# EAGLE design nico (EAGLE 7.1.0)
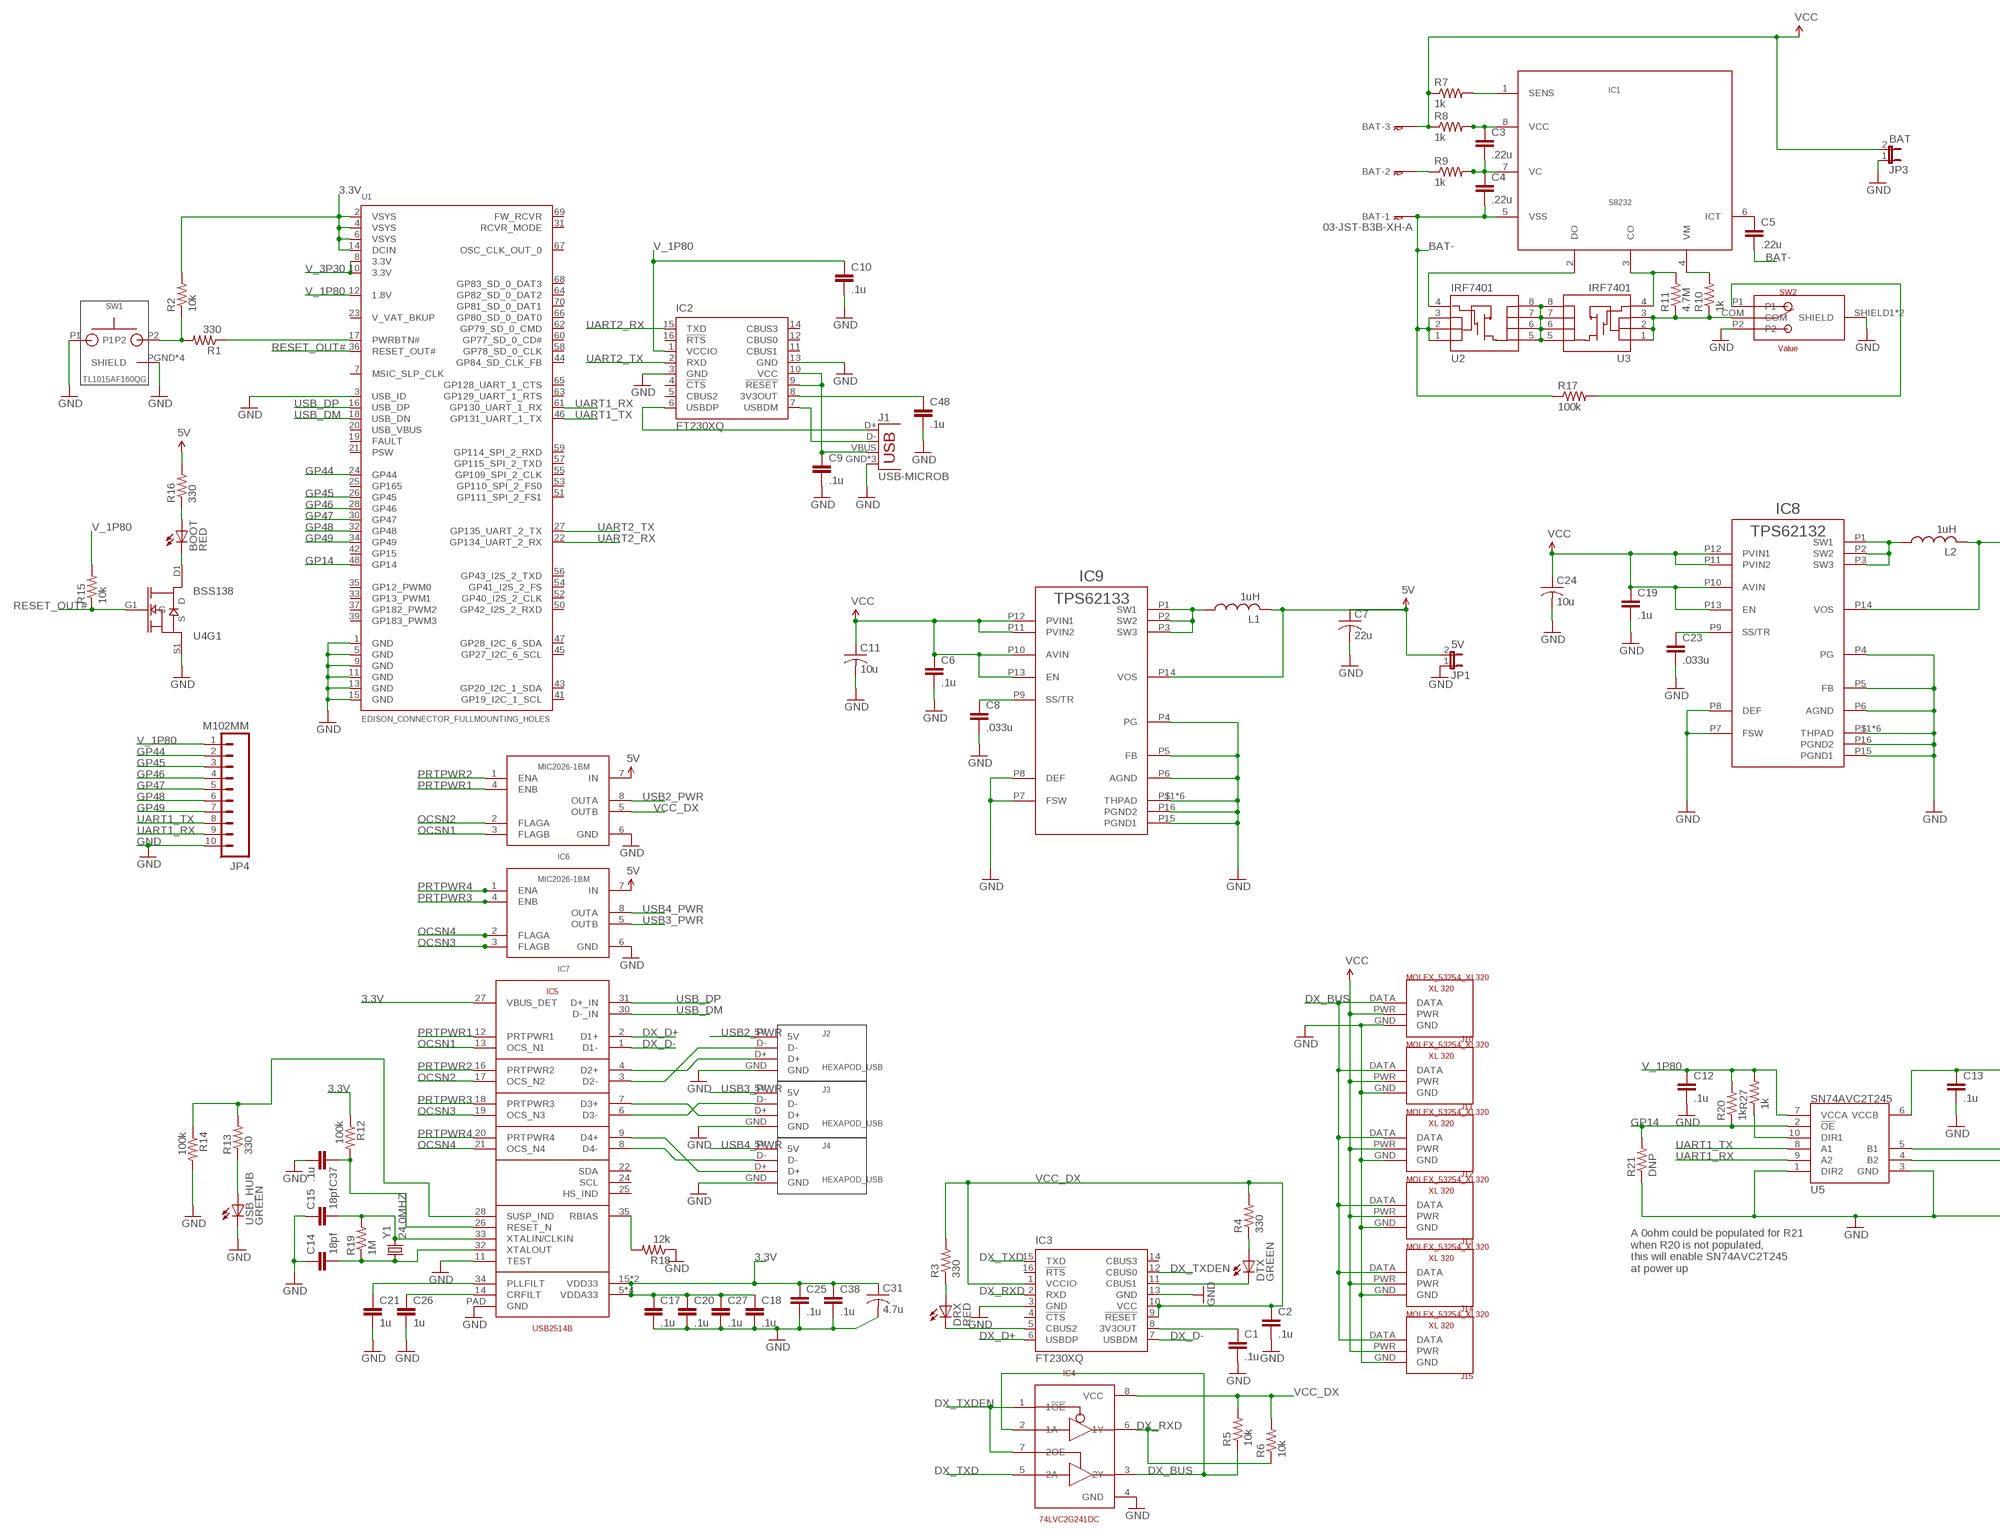
[diagram p0: schematic, sheet 1, part 1 of 2]
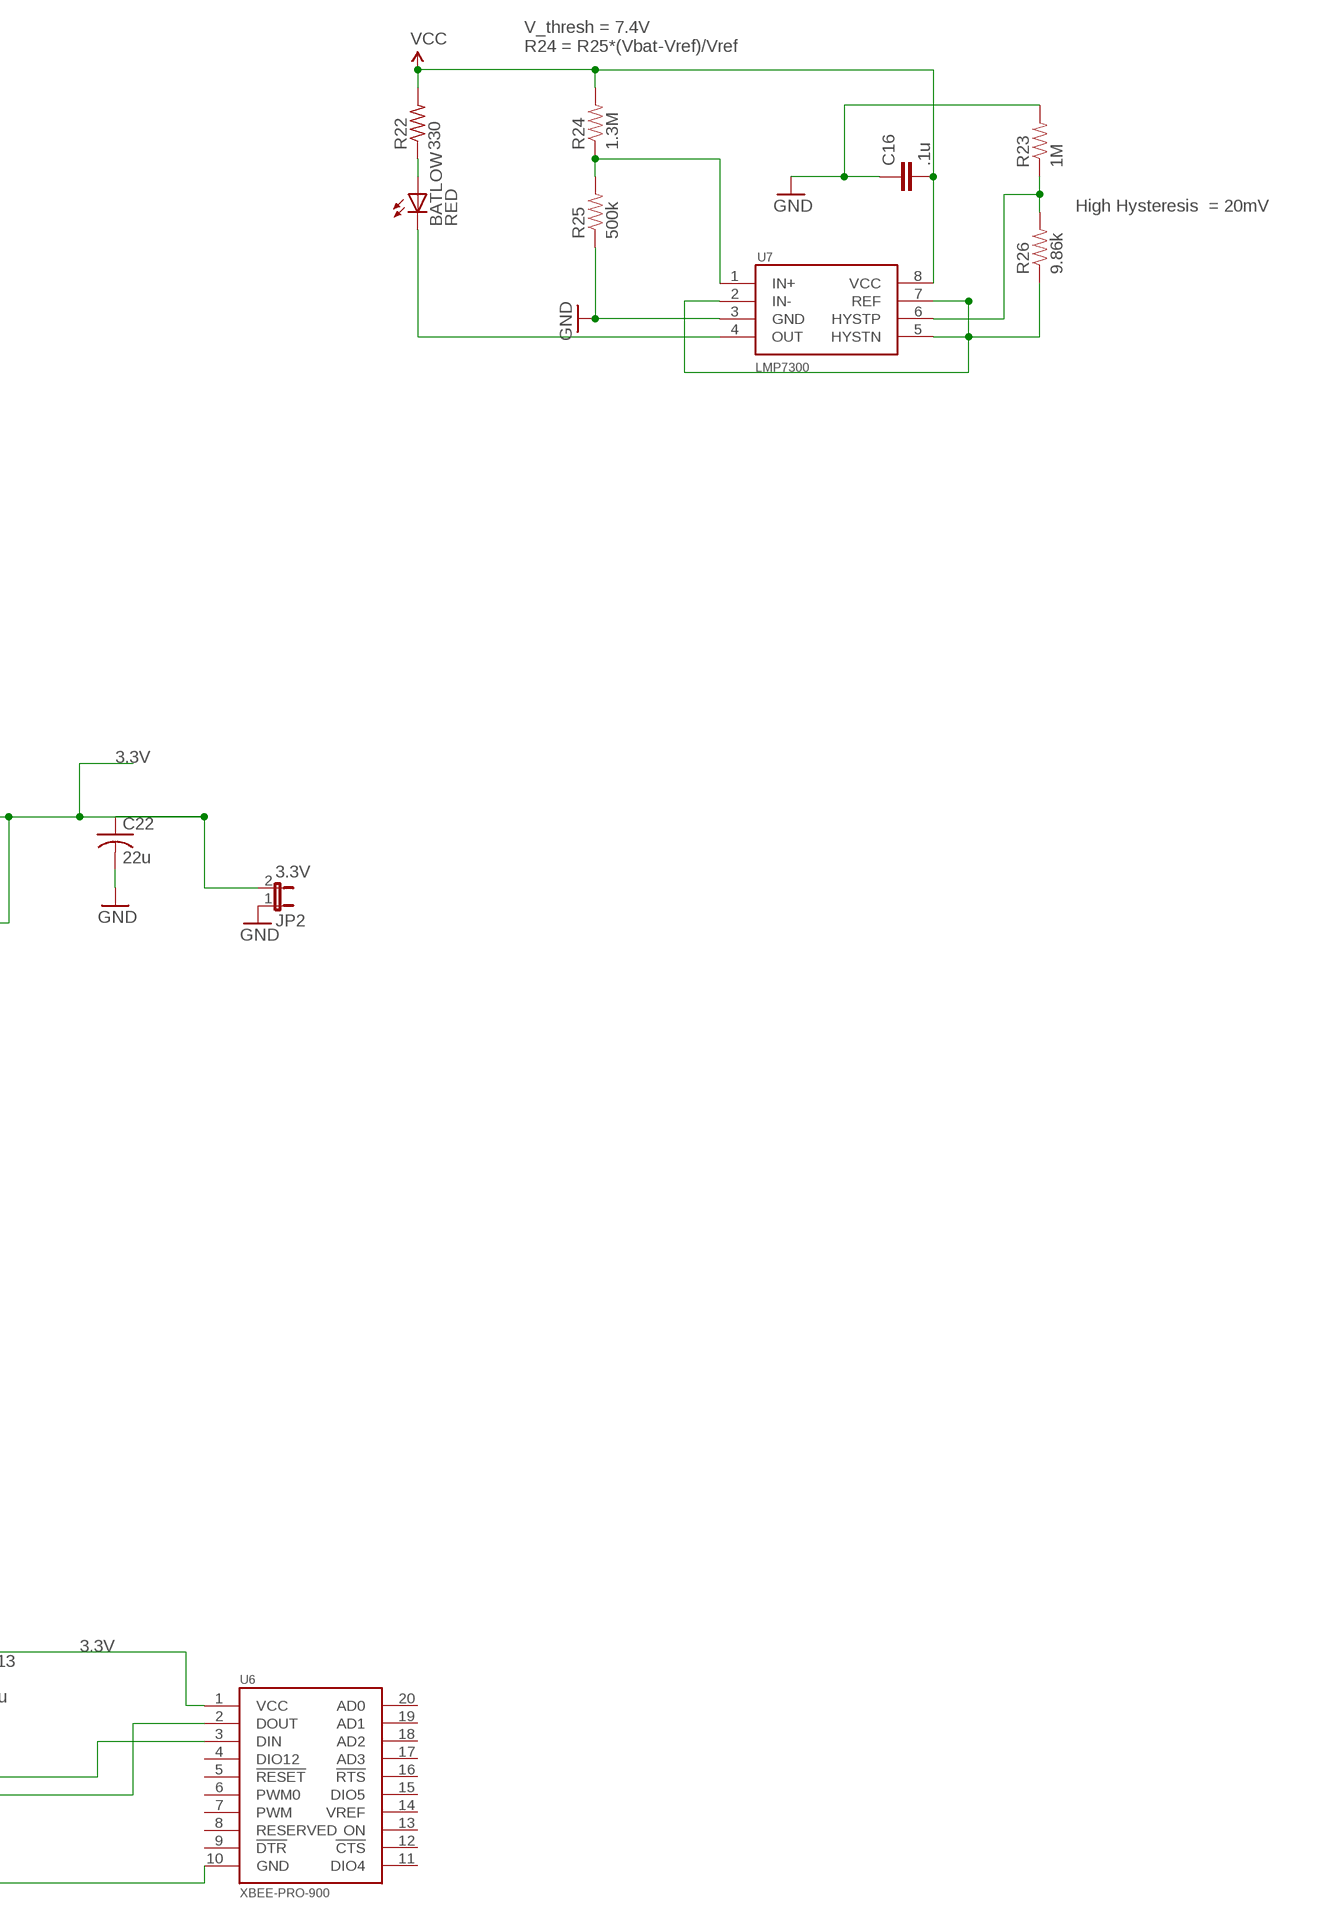
[diagram p1: schematic, sheet 1, part 2 of 2]

## Parts
BAT  03-JST-B3B-XH-A  [B3B-XH]
BATLOW  RED  LED0603  [LED-0603]
BOOT  RED  LED0603  [LED-0603]
C1  .1u  C-EUC0402  [C0402]
C2  .1u  C-EUC0402  [C0402]
C3  .22u  C-EUC0402  [C0402]
C4  .22u  C-EUC0402  [C0402]
C5  .22u  C-EUC0402  [C0402]
C6  .1u  C-EUC0402  [C0402]
C7  22u  C-USC0603  [C0603]
C8  .033u  C-EUC0402  [C0402]
C9  .1u  C-EUC0402  [C0402]
C10  .1u  C-EUC0402  [C0402]
C11  10u  C-USC0805  [C0805]
C12  .1u  C-EUC0402  [C0402]
C13  .1u  C-EUC0402  [C0402]
C14  18pf  C-EUC0402  [C0402]
C15  18pf  C-EUC0402  [C0402]
C16  .1u  C-EUC0402  [C0402]
C17  .1u  C-EUC0402  [C0402]
C18  .1u  C-EUC0402  [C0402]
C19  .1u  C-EUC0402  [C0402]
C20  .1u  C-EUC0402  [C0402]
C21  1u  C-EUC0402  [C0402]
C22  22u  C-USC0603  [C0603]
C23  .033u  C-EUC0402  [C0402]
C24  10u  C-USC0805  [C0805]
C25  .1u  C-EUC0402  [C0402]
C26  1u  C-EUC0402  [C0402]
C27  .1u  C-EUC0402  [C0402]
C31  4.7u  C-USC0603  [C0603]
C37  .1u  C-EUC0402  [C0402]
C38  .1u  C-EUC0402  [C0402]
C48  .1u  C-EUC0402  [C0402]
DRX  RED  LED0603  [LED-0603]
DTX  GREEN  LED0603  [LED-0603]
IC1  S8232  [TSSOP8]
IC2  FT230XQ  [QFN16]
IC3  FT230XQ  [QFN16]
IC4  74LVC2G241DC  [VSSOP]
IC5  USB2514B  [36-QFN]
IC6  MIC2026-1BM  [8-SOIC]
IC7  MIC2026-1BM  [8-SOIC]
IC8  TPS62132  TPS62133  [VQFN-16]
IC9  TPS62133  [VQFN-16]
J1  USB-MICROB  [USB-MICROB]
J2  HEXAPOD_USB  [MOLEX_53254_4POS]
J3  HEXAPOD_USB  [MOLEX_53254_4POS]
J4  HEXAPOD_USB  [MOLEX_53254_4POS]
J10  MOLEX_53254_XL320  [MOLES_53254_XL320]
J11  MOLEX_53254_XL320  [MOLES_53254_XL320]
J12  MOLEX_53254_XL320  [MOLES_53254_XL320]
J13  MOLEX_53254_XL320  [MOLES_53254_XL320]
J14  MOLEX_53254_XL320  [MOLES_53254_XL320]
J15  MOLEX_53254_XL320  [MOLES_53254_XL320]
JP1  5V  JUMPER-2PTH  [1X02]
JP2  3.3V  JUMPER-2PTH  [1X02]
JP3  BAT  JUMPER-2PTH  [1X02]
JP4  M102MM  [1X10-2MM]
L1  1uH  L-USL2825P  [L2825P]
L2  1uH  L-USL2825P  [L2825P]
R1  330  R-US_R0402  [R0402]
R2  10k  R-US_R0402  [R0402]
R3  330  R-US_R0402  [R0402]
R4  330  R-US_R0402  [R0402]
R5  10k  R-US_R0402  [R0402]
R6  10k  R-US_R0402  [R0402]
R7  1k  RESISTOR0402  [C0402]
R8  1k  RESISTOR0402  [C0402]
R9  1k  RESISTOR0402  [C0402]
R10  1k  RESISTOR0402  [C0402]
R11  4.7M  RESISTOR0402  [C0402]
R12  100k  RESISTOR0402  [C0402]
R13  330  R-US_R0402  [R0402]
R14  100k  RESISTOR0402  [C0402]
R15  10k  R-US_R0402  [R0402]
R16  330  R-US_R0402  [R0402]
R17  100k  RESISTOR0402  [C0402]
R18  12k  RESISTOR0402  [C0402]
R19  1M  RESISTOR0402  [C0402]
R20  1k  RESISTOR0402  [C0402]
R21  DNP  RESISTOR0402  [C0402]
R22  330  R-US_R0402  [R0402]
R23  1M  RESISTOR0402  [C0402]
R24  1.3M  RESISTOR0402  [C0402]
R25  500k  RESISTOR0402  [C0402]
R26  9.86k  RESISTOR0402  [C0402]
R27  1k  RESISTOR0402  [C0402]
SW1  TL1015AF160QG  [TL1015AF160QG]
SW2  TOGGLE_SWITCH_ET01MD1AGE  [TOGGLE_SWITCH_ET01MD1AGE]
U1  EDISON_CONNECTOR_FULLMOUNTING_HOLES  [EDISON_DAUGHTER]
U2  IRF7401  MOSFET-NCHANNEL-SOIC8  [SO08]
U3  IRF7401  MOSFET-NCHANNEL-SOIC8  [SO08]
U4  BSS138  [SOT363]
U5  SN74AVC2T245  [RSW-UQFN-10]
U6  XBEE-PRO-900  [XBEE-PRO-OEM]
U7  LMP7300  [8-SOIC]
USB_HUB  GREEN  LED0603  [LED-0603]
Y1  24.0MHZ  CRYSTAL5X3  [CRYSTAL-SMD-5X3]

## Nets
3.3V: C13.1 C17.1 C18.1 C20.1 C22.1 C25.1 C27.1 C31.1 C38.1 IC5.5(VDDA33) IC5.10(VDDA33) IC5.15(VDD33) IC5.23(VDD33) IC5.27(VBUS_DET) IC5.29(VDDA33) IC5.36(VDDA33) IC8.P14(VOS) JP2.2 L2.2 R2.2 R12.1 U1.2(VSYS) U1.4(VSYS) U1.6(VSYS) U1.14(DCIN) U5.6(VCCB) U6.1(VCC)
5V: C7.1 IC6.7(IN) IC7.7(IN) IC9.P14(VOS) JP1.2 L1.2 R16.2
BAT-: BAT.P$1 C4.2 C5.2 IC1.5(VSS) R17.1 U2.1(S) U2.2(S) U2.3(S)
DX_BUS: IC4.2(1A) IC4.3(2Y) J10.DATA J11.DATA J12.DATA J13.DATA J14.DATA J15.DATA R5.1
DX_D+: IC3.6(USBDP) IC5.2(D1+)
DX_D-: IC3.7(USBDM) IC5.1(D1-)
DX_RXD: IC3.2(RXD) IC4.6(1Y) R6.1
DX_TXD: IC3.15(TXD) IC4.5(2A)
DX_TXDEN: IC3.12(CBUS0) IC4.1(1!OE) IC4.7(2OE)
GND [GND]: C1.2 C2.2 C6.2 C7.2 C8.2 C9.2 C10.2 C11.2 C12.2 C13.2 C14.1 C15.1 C16.1 C17.2 C18.2 C19.2 C20.2 C21.2 C22.2 C23.2 C24.2 C25.2 C26.2 C27.2 C31.2 C37.2 C38.2 C48.2 IC2.3(GND) IC2.13(GND) IC3.3(GND) IC3.13(GND) IC4.4(GND) IC5.11(TEST) IC5.PAD(GND) IC6.6(GND) IC7.6(GND) IC8.P4(PG) IC8.P5(FB) IC8.P6(AGND) IC8.P7(FSW) IC8.P8(DEF) IC8.P15(PGND1) IC8.P16(PGND2) IC8.P$1(THPAD) IC8.P$2(THPAD) IC8.P$3(THPAD) IC8.P$4(THPAD) IC8.P$5(THPAD) IC8.P$6(THPAD) IC9.P4(PG) IC9.P5(FB) IC9.P6(AGND) IC9.P7(FSW) IC9.P8(DEF) IC9.P15(PGND1) IC9.P16(PGND2) IC9.P$1(THPAD) IC9.P$2(THPAD) IC9.P$3(THPAD) IC9.P$4(THPAD) IC9.P$5(THPAD) IC9.P$6(THPAD) J1.GND J1.MT1(GND) J1.MT2(GND) J2.GND J3.GND J4.GND J10.GND J11.GND J12.GND J13.GND J14.GND J15.GND JP1.1 JP2.1 JP3.1 JP4.10 R14.2 R18.1 R21.1 R23.2 R25.1 SW1.P1 SW1.PGND2(SHIELD) SW1.PGND3(SHIELD) SW1.PGND4(SHIELD) SW1.PGND(SHIELD) SW2.P2 SW2.SHIELD1(SHIELD) SW2.SHIELD2(SHIELD) U1.1(GND) U1.3(USB_ID) U1.5(GND) U1.9(GND) U1.11(GND) U1.13(GND) U1.15(GND) U4.S1(S) U5.1(DIR2) U5.3(GND) U6.10(GND) U7.3(GND) USB_HUB.C
GP14: R20.1 R21.2 U1.48(GP14) U5.2(!OE)
GP44: JP4.2 U1.24(GP44)
GP45: JP4.3 U1.26(GP45)
GP46: JP4.4 U1.28(GP46)
GP47: JP4.5 U1.30(GP47)
GP48: JP4.6 U1.32(GP48)
GP49: JP4.7 U1.34(GP49)
N$1: R1.2 R2.1 SW1.P2
N$2: DRX.C IC3.5(CBUS2)
N$3: C1.1 IC3.8(3V3OUT)
N$4: IC2.6(USBDP) J1.D+
N$5: C15.2 IC5.33(XTALIN/CLKIN) R19.2 Y1.3
N$6: C14.2 IC5.32(XTALOUT) R19.1 Y1.1
N$7: IC5.7(D3+) J3.D+
N$8: C3.2 C4.1 IC1.7(VC) R9.2
N$9: C3.1 IC1.8(VCC) R8.2
N$10: R1.1 U1.17(PWRBTN#)
N$11: C8.1 IC9.P9(SS/TR)
N$12: R13.1 USB_HUB.A
N$13: DTX.A R4.1
N$14: C21.1 IC5.34(PLLFILT)
N$15: C26.1 IC5.14(CRFILT)
N$16: DTX.C IC3.11(CBUS1)
N$17: IC8.P1(SW1) IC8.P2(SW2) IC8.P3(SW3) L2.1
N$18: IC2.7(USBDM) J1.D-
N$19: C37.1 IC5.26(RESET_N) R12.2
N$20: C9.1 IC2.9(!RESET) IC2.10(VCC) J1.VBUS
N$21: DRX.A R3.1
N$22: C23.1 IC8.P9(SS/TR)
N$23: IC5.9(D4+) J4.D+
N$24: IC5.28(SUSP_IND) R13.2 R14.1
N$25: C48.1 IC2.8(3V3OUT)
N$26: IC5.35(RBIAS) R18.2
N$27: IC5.8(D4-) J4.D-
N$28: C5.1 IC1.6(ICT)
N$29: IC1.1(SENS) R7.2
N$30: BAT.P$2 R9.1
N$31: IC5.6(D3-) J3.D-
N$32: IC1.4(VM) R10.2
N$33: R10.1 R11.1 SW2.COM U3.1(S) U3.2(S) U3.3(S)
N$34: BOOT.C U4.D1(D)
N$35: U2.5(D) U2.6(D) U2.7(D) U2.8(D) U3.5(D) U3.6(D) U3.7(D) U3.8(D)
N$36: BOOT.A R16.1
N$37: IC1.2(DO) U2.4(G)
N$38: IC1.3(CO) R11.2 U3.4(G)
N$39: IC5.3(D2-) J2.D-
N$40: IC5.4(D2+) J2.D+
N$41: IC9.P1(SW1) IC9.P2(SW2) IC9.P3(SW3) L1.1
N$42: R17.2 SW2.P1
N$43: BATLOW.C U7.4(OUT)
N$44: BATLOW.A R22.1
N$45: R26.1 U7.2(IN-) U7.5(HYSTN) U7.7(REF)
N$46: R23.1 R26.2 U7.6(HYSTP)
N$47: R24.1 R25.2 U7.1(IN+)
N$48: R27.1 U5.10(DIR1)
N$49: U5.5(B1) U6.3(DIN)
N$50: U5.4(B2) U6.2(DOUT)
OCSN1: IC5.13(OCS_N1) IC6.3(FLAGB)
OCSN2: IC5.17(OCS_N2) IC6.2(FLAGA)
OCSN3: IC5.19(OCS_N3) IC7.3(FLAGB)
OCSN4: IC5.21(OCS_N4) IC7.2(FLAGA)
PRTPWR1: IC5.12(PRTPWR1) IC6.4(ENB)
PRTPWR2: IC5.16(PRTPWR2) IC6.1(ENA)
PRTPWR3: IC5.18(PRTPWR3) IC7.4(ENB)
PRTPWR4: IC5.20(PRTPWR4) IC7.1(ENA)
RESET_OUT#: R15.1 U1.36(RESET_OUT#) U4.G1(G)
UART1_RX: JP4.9 U1.61(GP130_UART_1_RX) U5.9(A2)
UART1_TX: JP4.8 U1.46(GP131_UART_1_TX) U5.8(A1)
UART2_RX: IC2.15(TXD) U1.22(GP134_UART_2_RX)
UART2_TX: IC2.2(RXD) U1.27(GP135_UART_2_TX)
USB2_PWR: IC6.8(OUTA) J2.5V
USB3_PWR: IC7.5(OUTB) J3.5V
USB4_PWR: IC7.8(OUTA) J4.5V
USB_DM: IC5.30(D-_IN) U1.18(USB_DN)
USB_DP: IC5.31(D+_IN) U1.16(USB_DP)
V_1P80: C10.1 C12.1 IC2.1(VCCIO) JP4.1 R15.2 R20.2 R27.2 U1.12(1.8V) U5.7(VCCA)
V_3P30: U1.8(3.3V) U1.10(3.3V)
VCC: BAT.P$3 C6.1 C11.1 C16.2 C19.1 C24.1 IC8.P10(AVIN) IC8.P11(PVIN2) IC8.P12(PVIN1) IC8.P13(EN) IC9.P10(AVIN) IC9.P11(PVIN2) IC9.P12(PVIN1) IC9.P13(EN) J10.PWR J11.PWR J12.PWR J13.PWR J14.PWR J15.PWR JP3.2 R7.1 R8.1 R22.2 R24.2 U7.8(VCC)
VCC_DX: C2.1 IC3.1(VCCIO) IC3.9(!RESET) IC3.10(VCC) IC4.8(VCC) IC6.5(OUTB) R3.2 R4.2 R5.2 R6.2
Unconnected: IC2.4(!CTS) IC2.5(CBUS2) IC2.11(CBUS1) IC2.12(CBUS0) IC2.14(CBUS3) IC2.16(!RTS) IC3.4(!CTS) IC3.14(CBUS3) IC3.16(!RTS) IC5.22(SDA) IC5.24(SCL) IC5.25(HS_IND) U1.7(MSIC_SLP_CLK) U1.19(FAULT) U1.20(USB_VBUS) U1.21(PSW) U1.23(V_VAT_BKUP) U1.25(GP165) U1.31(RCVR_MODE) U1.33(GP13_PWM1) U1.35(GP12_PWM0) U1.37(GP182_PWM2) U1.39(GP183_PWM3) U1.41(GP19_I2C_1_SCL) U1.42(GP15) U1.43(GP20_I2C_1_SDA) U1.44(GP84_SD_CLK_FB) U1.45(GP27_I2C_6_SCL) U1.47(GP28_I2C_6_SDA) U1.50(GP42_I2S_2_RXD) U1.51(GP111_SPI_2_FS1) U1.52(GP40_I2S_2_CLK) U1.53(GP110_SPI_2_FS0) U1.54(GP41_I2S_2_FS) U1.55(GP109_SPI_2_CLK) U1.56(GP43_I2S_2_TXD) U1.57(GP115_SPI_2_TXD) U1.58(GP78_SD_0_CLK) U1.59(GP114_SPI_2_RXD) U1.60(GP77_SD_0_CD#) U1.62(GP79_SD_0_CMD) U1.63(GP129_UART_1_RTS) U1.64(GP82_SD_0_DAT2) U1.65(GP128_UART_1_CTS) U1.66(GP80_SD_0_DAT0) U1.67(OSC_CLK_OUT_0) U1.68(GP83_SD_0_DAT3) U1.69(FW_RCVR) U1.70(GP81_SD_0_DAT1) U4.D2(D) U4.G2(G) U4.S2(S) U6.4(DIO12) U6.5(!RESET) U6.6(PWM0) U6.7(PWM) U6.8(RESERVED) U6.9(!DTR) U6.11(DIO4) U6.12(!CTS) U6.13(ON) U6.14(VREF) U6.15(DIO5) U6.16(!RTS) U6.17(AD3) U6.18(AD2) U6.19(AD1) U6.20(AD0)

## Notes on the sheet
- V_thresh = 7.4V
  R24 = R25*(Vbat-Vref)/Vref
- High Hysteresis  = 20mV
- A 0ohm could be populated for R21 
  when R20 is not populated, 
  this will enable SN74AVC2T245 
  at power up

## Library data of the parts
BAT = con-jst-xh:03-JST: JST CONNECTOR
BATLOW BOOT DRX DTX USB_HUB = SparkFun:LED: LEDs Standard schematic elements and footprints for 5mm, 3mm, 1206, and 0603 sized LEDs. 5mm - Spark Fun Electronics SKU : COM-00529 (and others)
C1-C6 C8-C10 C12-C21 C23 C25-C27 C37 C38 C48 = rcl:C-EU: CAPACITOR, European symbol
C7 C22 C31 = resistor:C-US: CAPACITOR, American symbol
C11 C24 = rcl:C-US: CAPACITOR, American symbol
IC1 = Edison:S8232
IC2 IC3 = ftdichip:FT230X: USB to BASIC UART IC Auto generated by make-symbol-device-package-bsdl.ulp Rev. 43 Source: Data sheet <http://www.ftdichip.com/Support/Documents/DataSheets/ICs/DS_FT230X.pdf>
IC4 = Edison:74LVC2G241DC
IC5 = Edison:USB2514B
IC6 IC7 = Edison:MIC2026-1BM
IC8 IC9 = Edison:TPS62133
J1 = SparkFun-Connectors:USB: USB Connectors USB-B-PTH is fully proven SKU : PRT-00139/CONN-08278 USB-miniB is fully proven SKU : PRT-00587 USB-A-PCB is untested. USB-A-H is throughly reviewed, but untested. Spark Fun Electronics SKU : PRT-00437 USB-B-SMT is throughly reviewed, but untested. Needs silkscreen touching up. USB-A-S has not been used/tested USB-MB-H has not been used/tested USB-MICROB has been used. CONN-09505; PROD_ID: CONN-09505
J2-J4 = Edison:HEXAPOD_USB
J10-J15 = Edison:MOLEX_53254_XL320
JP1-JP3 = SparkFun:JUMPER-2: Jumper Basic 0.1" spaced jumper. Use with breakaway headers.
JP4 = SparkFun:M10: Header 10 Standard 10-pin 0.1" header. Use with straight break away headers (SKU : PRT-00116), right angle break away headers (PRT-00553), swiss pins (PRT-00743), machine pins (PRT-00117), and female headers (PRT-00115).
L1 L2 = rcl:L-US: INDUCTOR, American symbol
R1-R6 R13 R15 R16 R22 = rcl:R-US_: RESISTOR, American symbol
R7-R12 R14 R17-R21 R23-R27 = SparkFun:RESISTOR: Resistor Basic schematic elements and footprints for 0603, 1206, and PTH 1/10th watt (small) resistors.
SW1 = Edison:TL1015AF160QG
SW2 = Edison:TOGGLE_SWITCH_ET01MD1AGE
U1 = Edison:EDISON_CONNECTOR_FULL
U2 U3 = SparkFun:MOSFET-NCHANNEL-SOIC8: N-Channel MOSFET IRF9410 and NDS8434 are common, SOIC-8 parts.
U4 = Edison:BSS138
U5 = Edison:SN74AVC2T245
U6 = Edison:XBEE-PRO-900
U7 = Edison:LMP7300
Y1 = SparkFun:CRYSTAL: Crystals Various standard crystals. Proven footprints. Spark Fun Electronics SKU : COM-00534

## Net classes
1 GND: width 0.178 mm

## Board
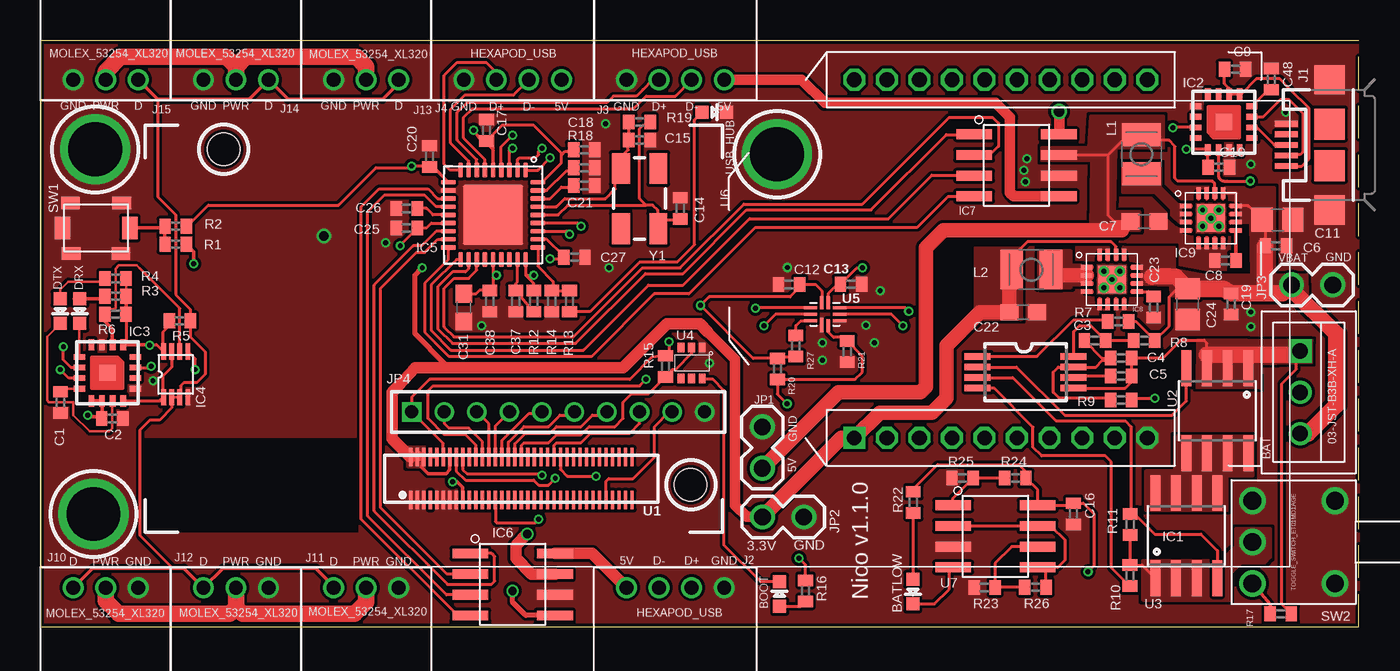
[diagram p2: board, top side]
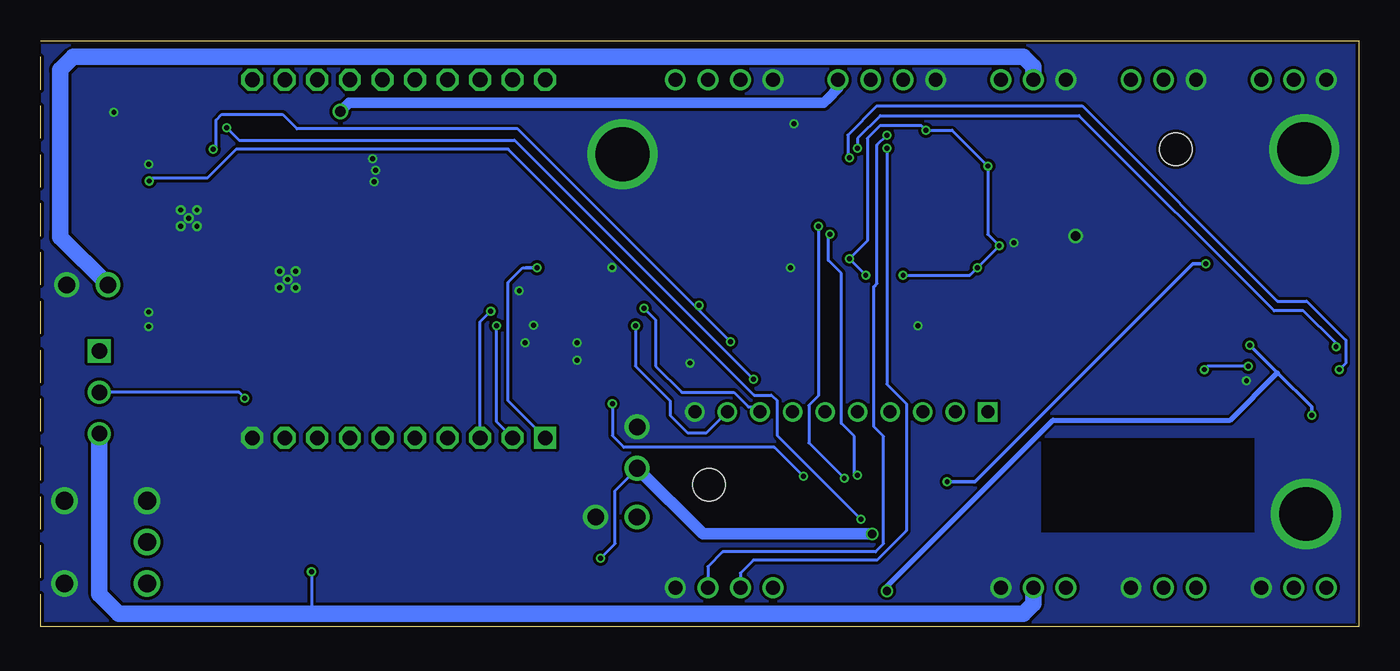
[diagram p3: board, bottom side, seen from below]

Size 81 x 36 mm. Coordinates in mm from the lower left corner, seen from the top.
Outline: 0,0 81,0 81,36 0,36 0,0
Copper layers (1*16): Top 0.035mm / dielectric 1.5mm / Bottom 0.035mm
Design rules "default *": minimum track width 5.5mil, minimum drill 10mil, track to track 7mil, track to pad 7mil, pad to pad 7mil, via to via 7mil, smd to smd 7mil, copper to edge 8mil, drill to drill 6mil, minimum pad ring 6mil, minimum via ring 5mil, stop-mask expansion 4mil, vias tented up to drill 0mil, thermal gap 10mil

### Footprints (pad centres in the part's own frame; a part is rotated, then mirrored left to right if it is on the bottom)
B3B-XH = drill 0.95 square: P$1 -2.54,0 | drill 0.95: P$2 0,0; P$3 2.54,0
LED-0603 = smd 0.8 x 0.8: A 0,-0.75; C 0,0.75
C0402 = smd 0.7 x 0.9: 1 -0.65,0; 2 0.65,0
C0603 = smd 1.1 x 1: 1 -0.85,0; 2 0.85,0
C0805 = smd 1.3 x 1.5: 1 -0.95,0; 2 0.95,0
TSSOP8 = smd 0.4 x 1.6: 1 -1.025,-2.85; 2 -0.375,-2.85; 3 0.275,-2.85; 4 0.925,-2.85; 5 0.925,3.05; 6 0.275,3.05; 7 -0.375,3.05; 8 -1.025,3.05
QFN16 = smd 0.7 x 0.35: 1 -1.725,0.975; 2 -1.725,0.325; 3 -1.725,-0.325; 4 -1.725,-0.975; 9 1.725,-0.975; 10 1.725,-0.325; 11 1.725,0.325; 12 1.725,0.975 | smd 0.35 x 0.7: 5 -0.975,-1.725; 6 -0.325,-1.725; 7 0.325,-1.725; 8 0.975,-1.725; 13 0.975,1.725; 14 0.325,1.725; 15 -0.325,1.725; 16 -0.975,1.725 | smd 1 x 1: TAB 0,0
VSSOP = smd 0.295 x 1: 1 0.75,1.4; 2 0.25,1.4; 3 -0.25,1.4; 4 -0.75,1.4; 5 -0.75,-1.4; 6 -0.25,-1.4; 7 0.25,-1.4; 8 0.75,-1.4
36-QFN = smd 0.9 x 0.28: 1 -2.75,2; 2 -2.75,1.5; 3 -2.75,1; 4 -2.75,0.5; 5 -2.75,0; 6 -2.75,-0.5; 7 -2.75,-1; 8 -2.75,-1.5; 9 -2.75,-2; 19 2.75,-2; 20 2.75,-1.5; 21 2.75,-1; 22 2.75,-0.5; 23 2.75,0; 24 2.75,0.5; 25 2.75,1; 26 2.75,1.5; 27 2.75,2 | smd 0.28 x 0.9: 10 -2,-2.75; 11 -1.5,-2.75; 12 -1,-2.75; 13 -0.5,-2.75; 14 0,-2.75; 15 0.5,-2.75; 16 1,-2.75; 17 1.5,-2.75; 18 2,-2.75; 28 2,2.75; 29 1.5,2.75; 30 1,2.75; 31 0.5,2.75; 32 0,2.75; 33 -0.5,2.75; 34 -1,2.75; 35 -1.5,2.75; 36 -2,2.75 | smd 3.7 x 3.7: PAD 0,0
8-SOIC = smd 2.2 x 0.6: 1 -2.6,1.905; 2 -2.6,0.635; 3 -2.6,-0.635; 4 -2.6,-1.905; 5 2.6,-1.905; 6 2.6,-0.635; 7 2.6,0.635; 8 2.6,1.905
VQFN-16 = smd 0.71 x 0.28: P1 -1.545,0.75; P2 -1.545,0.25; P3 -1.545,-0.25; P4 -1.545,-0.75; P9 1.545,-0.75; P10 1.545,-0.25; P11 1.545,0.25; P12 1.545,0.75 | smd 0.28 x 0.71: P5 -0.75,-1.545; P6 -0.25,-1.545; P7 0.25,-1.545; P8 0.75,-1.545; P13 0.75,1.545; P14 0.25,1.545; P15 -0.25,1.545; P16 -0.75,1.545 | smd 1.7 x 1.7: P$1 0,0 | drill 0.3 pad 0.508: P$2 -0.5,0.5; P$3 0.5,0.5; P$4 0,0; P$5 0.5,-0.5; P$6 -0.5,-0.5
USB-MICROB = smd 0.35 x 1.4: D+ 0,2.65; D- -0.65,2.65; GND 1.3,2.65; ID 0.65,2.65; VBUS -1.3,2.65 | smd 1.8 x 1.9: MT1 -4,0; MT2 4,0 | smd 1.9 x 1.9: P$1 -1.27,0; P$2 1.27,0
MOLEX_53254_4POS = drill 0.85: 5V 4,0; D+ 0,0; D- 2,0; GND -2,0
MOLES_53254_XL320 = drill 0.85: DATA 2,0; GND -2,0; PWR 0,0
1X02 = drill 1.016: 1 0,0; 2 2.54,0
1X10-2MM = drill 0.8 square: 1 0,0 | drill 0.8: 2 2,0; 3 4,0; 4 6,0; 5 8,0; 6 10,0; 7 12,0; 8 14,0; 9 16,0; 10 18,0
L2825P = smd 1.4 x 2.4: 1 -1.2,0; 2 1.2,0
R0402 = smd 0.7 x 0.9: 1 -0.65,0; 2 0.65,0
TL1015AF160QG = smd 0.95 x 1.4: P1 -2.075,0; P2 2.075,0 | smd 1.15 x 0.75: PGND -1.575,1.525; PGND2 1.575,1.525; PGND3 1.525,-1.575; PGND4 -1.525,-1.575
TOGGLE_SWITCH_ET01MD1AGE = drill 1.092: COM 0,2.54; P1 -2.54,2.54; P2 2.54,2.54; SHIELD1 -2.54,-2.54; SHIELD2 2.54,-2.54
EDISON_DAUGHTER = smd 1.14 x 0.2: 1 -0.95,17.21; 2 1.69,17.21; 3 -0.95,16.81; 4 1.69,16.81; 5 -0.95,16.41; 6 1.69,16.41; 7 -0.95,16.01; 8 1.69,16.01; 9 -0.95,15.61; 10 1.69,15.61; 11 -0.95,15.21; 12 1.69,15.21; 13 -0.95,14.81; 14 1.69,14.81; 15 -0.95,14.41; 16 1.69,14.41; 17 -0.95,14.01; 18 1.69,14.01; 19 -0.95,13.61; 20 1.69,13.61; 21 -0.95,13.21; 22 1.69,13.21; 23 -0.95,12.81; 24 1.69,12.81; 25 -0.95,12.41; 26 1.69,12.41; 27 -0.95,12.01; 28 1.69,12.01; 29 -0.95,11.61; 30 1.69,11.61; 31 -0.95,11.21; 32 1.69,11.21; 33 -0.95,10.81; 34 1.69,10.81; 35 -0.95,10.41; 36 1.69,10.41; 37 -0.95,10.01; 38 1.69,10.01; 39 -0.95,9.61; 40 1.69,9.61; 41 -0.95,9.21; 42 1.69,9.21; 43 -0.95,8.81; 44 1.69,8.81; 45 -0.95,8.41; 46 1.69,8.41; 47 -0.95,8.01; 48 1.69,8.01; 49 -0.95,7.61; 50 1.69,7.61; 51 -0.95,7.21; 52 1.69,7.21; 53 -0.95,6.81; 54 1.69,6.81; 55 -0.95,6.41; 56 1.69,6.41; 57 -0.95,6.01; 58 1.69,6.01; 59 -0.95,5.61; 60 1.69,5.61; 61 -0.95,5.21; 62 1.69,5.21; 63 -0.95,4.81; 64 1.69,4.81; 65 -0.95,4.41; 66 1.69,4.41; 67 -0.95,4.01; 68 1.69,4.01; 69 -0.95,3.61; 70 1.69,3.61 | hole 2: 20.6,28.71; 0,0.02
SO08 = smd 0.61 x 2.21: 1 -1.905,-2.616; 2 -0.635,-2.616; 3 0.635,-2.616; 4 1.905,-2.616; 5 1.905,2.616; 6 0.635,2.616; 7 -0.635,2.616; 8 -1.905,2.616
SOT363 = smd 0.42 x 0.6: D1 0.65,-0.95; D2 -0.65,0.95; G1 0,0.95; G2 0,-0.95; S1 0.65,0.95; S2 -0.65,-0.95
RSW-UQFN-10 = smd 0.2 x 0.9: 1 0,0.05 | smd 0.2 x 0.8: 2 0.4,0; 6 0.4,1.4; 7 0,1.4 | smd 0.8 x 0.2: 3 1.1,0.3; 4 1.1,0.7; 5 1.1,1.1; 8 -0.7,1.1; 9 -0.7,0.7; 10 -0.7,0.3
XBEE-PRO-OEM = drill 0.9 square: 1 0,0 | drill 0.9 octagon: 2 0,-2; 3 0,-4; 4 0,-6; 5 0,-8; 6 0,-10; 7 0,-12; 8 0,-14; 9 0,-16; 10 0,-18; 11 22,-18; 12 22,-16; 13 22,-14; 14 22,-12; 15 22,-10; 16 22,-8; 17 22,-6; 18 22,-4; 19 22,-2; 20 22,0
CRYSTAL-SMD-5X3 = smd 1.9 x 1.1: 1 -1.85,-1.15; 2 1.85,-1.15; 3 1.85,1.15; 4 -1.85,1.15

### Placement (x,y rotation side)
BAT  77.4,14.4 270 top
BATLOW  53.59,2.16 180 top
BOOT  45.4,2 0 top
C1  1.22,13.79 270 top
C2  4.4,12.8 0 top
C3  64.78,17.59 180 top
C4  66.39,16.5 0 top
C5  66.39,15.41 0 top
C6  75.9,23.4 0 top
C7  67.82,24.89 0 top
C8  72.8,22.5 180 top
C9  73.4,34.25 0 top
C10  72.4,28.23 0 top
C11  76,25 0 top
C12  45.99,21.03 180 top
C13  49.8,21.04 0 top
C14  39.3,25.7 270 top
C15  36.8,29.9 180 top
C16  63.46,6.94 90 top
C17  27.4,30.5 90 top
C18  33.4,29.3 0 top
C19  73.16,19.82 270 top
C20  23.9,28.9 90 top
C21  33.4,27.1 0 top
C22  60.37,19.32 0 top
C23  68.39,19.64 270 top
C24  70.49,19.82 270 top
C25  22.5,24.5 180 top
C26  22.5,25.7 180 top
C27  32.8,22.7 0 top
C31  26,19.6 270 top
C37  29.2,20 270 top
C38  27.6,20 270 top
C48  75.62,33.64 90 top
DRX  2.4,19.4 180 top
DTX  1.2,19.4 180 top
IC1  60.42,15.58 270 top
IC2  72.7,31 90 top
IC3  4.1,15.6 270 top
IC4  8.3,15.5 180 top
IC5  27.8,25.3 270 top
IC6  29,2.6 0 top
IC7  59.97,28.34 0 top
IC8  65.82,21.33 0 top
IC9  71.9,25.1 0 top
J1  79.2,29.6 90 top
J2  40,2.4 180 top
J3  38,33.6 0 top
J4  28,33.6 0 top
J10  4,2.4 180 top
J11  20,2.4 180 top
J12  12,2.4 180 top
J13  20,33.6 0 top
J14  12,33.6 0 top
J15  4,33.6 0 top
JP1  44.35,12.28 270 top
JP2  46.9,6.74 180 top
JP3  79.4,21 180 top
JP4  22.8,13.2 0 top
L1  67.64,29.02 90 top
L2  60.87,21.94 180 top
R1  8.3,23.5 180 top
R2  8.3,24.6 0 top
R3  4.6,20.3 0 top
R4  4.6,21.4 0 top
R5  8.55,18.8 180 top
R6  4.6,19.2 0 top
R7  66.21,18.76 180 top
R8  67.81,17.58 180 top
R9  66.39,13.92 180 top
R10  66.93,3.14 270 top
R11  66.94,6.28 90 top
R12  30.3,20 270 top
R13  32.5,20 90 top
R14  31.4,20 270 top
R15  38.4,16 90 top
R16  47,2.2 90 top
R17  76.2,0.8 180 top
R18  33.4,28.2 180 top
R19  36.8,31 180 top
R20  45.27,15.84 90 top
R21  49.56,16.91 90 top
R22  53.62,7.64 90 top
R23  58,2.42 180 top
R24  59.89,9.13 0 top
R25  56.65,9.13 0 top
R26  61.13,2.43 180 top
R27  46.41,17.25 270 top
SW1  3.4,24.5 0 top
SW2  77,5.2 90 top
U1  39.95,8.73 90 top
U2  72.3,13.27 180 top
U3  70.4,5.6 0 top
U4  40,16.2 0 top
U5  48,18.49 0 top
U6  50,11.6 90 top
U7  58.67,5.55 0 top
USB_HUB  41.4,31.6 270 top
Y1  36.8,26.3 90 top

### Tracks (layer width: path | path; a pad name or v marks a point on that pad's centre or on a via)
3.3V  (via drill 0.3)
  Top 0.175: IC5.15 24,24.8 23.7,24.5 C25.1 22.1,23.45 v22.1,23.4 | C20.1 24.25,28.1 IC5.10 25.05,27.35 24.1,28.3 v22.8,28.3 22.7,28.2 20.6,28.2 18.3,25.9 10.3,25.9 9,24.6 R2.2 | IC5.29 31.1,23.8 32.15,22.75 C27.1 32.05,22.6 v31.3,22.6 | R12.1 30.3,21.1 29.8,21.6 | C31.1 26.75,20.45 27,20.7 27.55,20.7 C38.1 27.8,20.85 IC5.23 27.8,21.8 v28,21.6 | 32,29 32,28.5 30.8,27.3 IC5.36 | 32,29 32.2,29.2 32.65,29.2 C18.1 | IC5.27 29.8,21.6 | 29.8,21.6 v30.3,21.6 | 32,29 32,29.1 30.3,30.8 28.35,30.8 C17.1 27.25,29.85 27.8,29.3 IC5.5 27.8,29.4 27.4,29.8 27.1,29.8 v26.6,30.5
  Top 0.178: IC8.P14 66.07,23.36 65.79,23.65 60.63,23.65 59.67,22.69 L2.2 | U5.6 48.4,20.48 48.95,21.04 C13.1 50.16,22.05 v50.49,22.05
  Top 0.2: U1.14 25.14,9.64 24.9,9.4 23.8,9.4 23.4,9.8 23.5,10.37 U1.6
  Top 0.3: v23.45,22.05 23,21.6 23,18 24.8,16.2 24.8,16.1 24.6,15.9
  Top 0.6: 23.2,10.47 U1.4
  Top 0.635: 41,18.1 42.67,16.43 42.67,7.47 43.4,6.74 JP2.2
  Top 0.7: 41,18.1 40.5,18.6 38.5,18.6 35.8,15.9 24.6,15.9 23,15.9 22,14.8 21.6,14.4 21.6,11.56 U1.2
  Top 0.889: JP2.2 49.21,11.6 U6.1 51.56,13.16 54.76,13.16 55.65,14.05 55.65,17.25 57.72,19.32 C22.1 59.52,21.79 arc-90 L2.2
  Top 1.016: 50.14,11.74 U6.1
  Bottom 0.175: v30.3,21.6 v31.3,22.6 30.2,23.7 30.2,30 29.4,30.8 26.9,30.8 v26.6,30.5 25,30.5 v22.8,28.3 22.8,24.1 v22.1,23.4 23.35,22.15 | v28,21.6 23.9,21.6 v23.45,22.05
  Bottom 0.178: 51.21,22.05 v50.49,22.05 51.38,22.05 52.27,21.16 52.27,13.87 U6.1
  Bottom 0.3: v23.45,22.05 23.35,22.15
  pour Top (no thermals): 22.55,11.07 23.72,11.07 23.72,9.8 22.55,9.8
  pour Top (no thermals): 60.27,23.11 60.27,18.85 57.96,18.85 57.43,18.85 57.43,23.29 60.27,23.29
5V  (via drill 0.3, 0.5)
  Top 0.175: R16.2 47,3.8 v46.6,4.2
  Top 0.178: IC9.P14 72.15,27.24 72.01,27.38 69.88,27.38 69.7,27.56 69.7,29.52 69.34,29.87 68,29.87 L1.2 | IC7.7 65.61,28.98 | 65.61,28.98 67.03,30.4 | C7.1 65.97,24.89 65.61,25.25 65.61,28.98
  Top 0.7: IC6.7 30.16,3.23 29.2,4.2 29.2,5 v29.9,5.7
  Top 0.711: C7.1 66.44,24.36
  Top 0.889: 66.44,24.36 55.47,24.36 54.41,23.29 54.41,14.76 54.05,14.4 49.01,14.4 JP1.2
  Bottom 0.175: v46.6,4.2 46.8,4.2
  Bottom 0.178: v46.6,4.2 45.7,5.11 45.7,8.36 44.35,9.7 JP1.2
  Bottom 0.711: JP1.2 40.31,5.7 v29.9,5.7
  pour Top (no thermals): 61.49,28.64 64.56,28.64 64.49,24.31 67.29,24.36 67.56,24.36 67.56,25.49 66.02,25.49 66.09,29.42 69.02,29.42 69.02,31.36 64.49,31.36 64.38,29.42 61.49,29.42
BAT-
  Top 0.178: IC1.5 63.58,14.58 63.65,14.66 66.65,14.66 67.04,15.04 C5.2 C4.2 68.95,16.5 70.05,17.6 71.48,17.6 71.67,17.41 71.67,16.71 U2.3 | R17.1 76.28,1.37 76.28,14.94 77.17,15.82 77.17,16.7 BAT.P$1
  Top 1.016: BAT.P$1 77.17,16.71 71.67,16.71
  pour Top (no thermals): 78.1,16.23 78.1,17.4 78.13,17.6 74.88,17.6 74.51,17.6 74.11,17.64 73.73,17.62 73.45,17.62 71.07,17.63 71.04,14.69 74.9,14.64 74.88,16.11
DX_BUS
  Top 0.15: IC4.3 IC4.2
  Top 0.175: 7.2,32.4 7.2,26.4 8.3,25.3 8.3,20.4 9.2,19.5 R5.1 9.2,17.8 10.1,16.9 10.1,15.5 9.6,15 8.8,15 8.6,14.8 8.6,14.15 IC4.3 | 8.8,3.6 8.1,3.6 6.1,5.6 6.1,12.1 6.7,12.7 7.3,12.7 8.05,13.45 IC4.2
  Top 0.2: J10.DATA 3.2,3.6 8.8,3.6 J12.DATA 11.2,3.6 16.9,3.6 18,2.5 J11.DATA | J15.DATA 7.2,32.4 12.8,32.4 J14.DATA 15.2,32.4 21,32.4 22,33.4 J13.DATA
DX_D+  (via drill 0.3)
  Top 0.175: IC3.6 1.88,15.93 1.4,16.4 v1.4,17.2 | IC5.2 29.3,28.7 29.4,28.8 30.4,28.8 30.6,29 30.6,29.2 v30.8,29.4
  Bottom 0.175: v1.4,17.2 1.4,17.4 3.4,19.4 5.2,19.4 17.2,31.4 29.4,31.4 30.8,30 v30.8,29.4
DX_D-  (via drill 0.3)
  Top 0.175: IC5.1 30.55,28.05 v31.3,28.8 | IC3.7 1.73,15.28 v1.2,15.8
  Bottom 0.175: 31.2,28.9 v31.3,28.8 31.4,28.9 31.4,30.2 29.6,32 17,32 5,20 3.2,20 0.8,17.6 0.8,16.2 v1.2,15.8
DX_RXD
  Top 0.15: 6.1,22 5.9,22.2 4.8,22.2 4.6,22 4.6,19.6 4.5,19.5 4.25,19.5 R6.1
  Top 0.175: IC4.6 8.55,19.55 6.1,22
  Top 0.2: R6.1 3.95,18.75 4.4,18.3 4.4,17.35 IC3.2
DX_TXD  (via drill 0.3)
  Top 0.175: IC3.15 6.72,15.93 v6.8,16 | v9.5,15.8 9.5,16.45 IC4.5
  Bottom 0.175: v6.8,16 9.3,16 v9.5,15.8
DX_TXDEN
  Top 0.175: IC3.12 7.33,13.88 IC4.1 7.5,14.15 7.5,15.4 8.05,15.95 IC4.7
GND  (via drill 0.3, 0.6, 3.3 pad 0.01)
  other vias: 45.25,29.03 3.35,29.33 3.25,6.93 76.5,31.6 27.1,18.5 21.2,23.6 60.51,27.34 60.61,28.74 34.7,30.9 41.1,16.2 17.4,24 60.41,28.04 6.9,15.1 48.03,17.44 50.7,18.51 48.03,16.38 51.23,17.44 45.9,22.07 51.59,20.64 34.92,22.06 74.37,28.4 74.37,19.33 74.37,18.44
  pour Bottom (no thermals): 0.25,35.76 80.91,35.74 80.96,0.4 0.22,0.16
  pour Top (rank 2, no thermals): 0.91,35.86 80.91,35.76 80.96,0.2 0.16,0.06 0.25,35.74
GP14  (via drill 0.3)
  Top 0.178: U1.48 31.94,9.66 32.36,9.25 v34.14,9.25 | v45.87,13.69 45.27,14.29 R20.1 50.04,15.19 50.49,15.65 50.49,16.62 R21.2 49.34,17.78 48.72,17.78 48.4,18.1 U5.2
  Bottom 0.178: v34.14,9.25 35.92,11.02 45.16,11.02 45.87,11.73 v45.87,13.69
GP44
  Top 0.175: JP4.2 24.8,12.5 25.1,12.2 26.3,12.2 27.14,11.36 U1.24
GP45
  Top 0.175: U1.26 27.54,12.46 JP4.3
GP46
  Top 0.175: U1.28 27.94,12.34 JP4.4
GP47
  Top 0.175: U1.30 28.34,11.44 30,13.1 30.7,13.1 JP4.5
GP48
  Top 0.175: U1.32 28.74,11.34 29.7,12.3 31.2,12.3 31.9,13 32.6,13 JP4.6
GP49
  Top 0.175: U1.34 29.14,11.24 29.8,11.9 31.3,11.9 31.7,12.3 33.2,12.3 33.9,13 34.6,13 JP4.7
N$1
  Top 0.2: SW1.P2 7.55,24.5 R2.1 7.6,24.65 R1.2
N$2
  Top 0.15: IC3.5 2.38,18.27 DRX.C
N$3
  Top 0.15: IC3.8 1.41,14.62 C1.1
N$4
  Top 0.175: J1.D+ 75.8,29.6
  Top 0.178: IC2.6 74.72,30.68 75.8,29.6 76.37,29.6 76.45,29.52
N$5
  Top 0.175: R19.2 C15.2 36.1,29.85 36.1,29.3 35.65,28.85 Y1.3 35.3,27.8 35.3,26.9 34.7,26.3 32.2,26.3 31.7,25.8 IC5.33
N$6
  Top 0.175: IC5.32 31.8,25.3 32.4,25.9 37.2,25.9 | C14.2 39.25,25 38.5,25 Y1.1 37.9,24.5 37.9,25.6 37.6,25.9 37.2,25.9 | 37.2,25.9 36.8,26.3 36.8,30.6 37,30.8 37.25,30.8 R19.1
N$7
  Top 0.175: IC5.7 26.8,28.7 25.6,29.9 25.6,31.6 26.2,32.2 34.8,32.2 35.2,32.6 36.6,32.6 37,33
  Top 0.178: 37,33 37.6,33.6 J3.D+
N$8
  Top 0.178: 65.96,13.69 65.96,13.7 R9.2 65.61,14.05 62.59,14.05 62.23,14.4 62.23,15.65 62.54,15.95 IC1.7 64.85,15.95 65.25,16.36 65.59,16.36 C4.1 65.22,16.5 C3.2
N$9
  Top 0.178: R8.2 C3.1 64.53,18.49 63.83,18.49 63.48,18.14 IC1.8
N$10  (via drill 0.3)
  Top 0.2: U1.17 25.94,8.56 25.6,8.9 v25.3,8.9 | v9.4,22.3 9.4,23.05 R1.1
  Bottom 0.2: v9.4,22.3 10.2,22.3 23.6,8.9 v25.3,8.9
N$11
  Top 0.2: C8.1 73.45,24.16 IC9.P9
N$12
  Top 0.178: R13.1 33.75,19.35 36.8,22.4 39.12,22.4 40.18,23.47 40.18,31.13 USB_HUB.A
N$13
  Top 0.15: DTX.A 1.2,20.7 1.7,21.2 3.75,21.2 R4.1
N$14
  Top 0.175: IC5.34 31.3,26.3 32,27 32.65,27 C21.1
N$15
  Top 0.175: IC5.14 24.1,25.3 23.7,25.7 C26.1
N$16
  Top 0.15: DTX.C 1.2,18.6 0.4,17.8 0.4,13.9 0.5,13.8 2,13.8 2,13 3,12 4.2,12 4.4,12.2 4.4,13.85 IC3.11
N$17
  Top 0.889: IC8.P2 62.43,21.58 arc-90 L2.1
  pour Top (no thermals): 61.34,23.11 63.3,23.11 63.3,22.23 64.72,22.23 64.72,20.98 63.3,20.98 63.3,20.8 61.34,20.8
N$18
  Top 0.175: J1.D- 76.6,29 77.4,29 77.55,29.15 77.55,31.55 76.7,32.4 76.2,32.4 75.5,31.7
  Top 0.178: IC2.7 75.12,31.32 75.5,31.7
N$19
  Top 0.175: R12.2 C37.1 29.2,21.1 29.3,21.2 IC5.26
N$20
  Top 0.175: J1.VBUS 77.5,28.3 77.95,28.75 77.95,31.85 76.8,33 | IC2.9 IC2.10
  Top 0.178: IC2.10 73.03,33.08 72.75,33.36 C9.1 | 76.8,33 76.14,33.66 74.7,33.66 73.77,32.73 IC2.9
N$21
  Top 0.15: DRX.A 2.05,20.15
  Top 0.2: 2.05,20.15 3.8,20.15 R3.1
N$22
  Top 0.152: 68.41,20.5 C23.1
  Top 0.178: IC8.P9 68.09,20.58 C23.1
N$23
  Top 0.175: IC5.9 25.15,28.05 24.8,28.4 24.8,32.1
  Top 0.178: 24.8,32.1 24.8,33.87 25.6,34.67 27.38,34.67 27.91,34.14 27.91,33.69 J4.D+
N$24
  Top 0.175: IC5.28 30.55,22.15 31.5,21.2 31.5,20.75 R14.1 R13.2
N$25
  Top 0.178: C48.1 75.31,32.86 IC2.8
N$26
  Top 0.175: IC5.35 31.1,26.8 32.3,28 32.55,28 R18.2
N$27
  Top 0.175: IC5.8 26.3,28.6 25.2,29.7 25.2,31.8
  Top 0.178: 25.2,31.8 26.06,32.66 29.06,32.66 J4.D-
N$28
  Top 0.178: IC1.6 63.58,15.41 C5.1
N$29
  Top 0.178: IC1.1 61.23,16.6 63.48,18.85 65.47,18.85 R7.2
N$30  (via drill 0.3)
  Top 0.178: R9.1 67.17,14.05 v68.45,14.05
  Bottom 0.178: v68.45,14.05 68.81,14.4 BAT.P$2
N$31
  Top 0.175: IC5.6 27.3,28.7 26,30 26,31.3 26.5,31.8 36.4,31.8 37.2,32.6
  Top 0.178: 37.2,32.6 39,32.6 J3.D-
N$32
  Top 0.178: R10.2 65.79,3.64 65.79,10.13 65.43,10.49 61.52,10.49 60.98,11.02 60.98,12.27 58.6,14.65 IC1.4
N$33
  Top 0.178: R11.1 R10.1 67.69,3.79 U3.1
  pour Top (no thermals): 68.28,4.09 72.54,4.09 73.43,4.98 73.43,6.05 75.56,6.05 75.56,4.27 75.21,3.91 73.79,3.91 73.08,3.2 73.08,1.78 73.08,1.6 67.74,1.6 67.74,4.09
N$34
  Top 0.175: BOOT.C 44.25,2.75 42,5 42,14.5 41.3,15.2 40.7,15.2 U4.D1
N$35
  pour Top (no thermals): 70.05,11.73 74.5,11.73 74.5,9.25 72.9,9.25 72.9,7.11 67.92,7.11 67.92,9.6 69.52,9.6 69.7,9.6 69.7,11.73
N$36
  Top 0.175: BOOT.A 46.7,1.25 R16.1
N$37
  Top 0.178: IC1.2 59.97,15.95 62.94,12.98 69.52,12.98 70.41,13.87 70.41,15.87 U2.4
N$38
  Top 0.178: U3.4 72.31,4.68 71.3,5.69 68.45,5.69 67.21,6.93 R11.2 67.03,7.02 67.03,12.27 66.67,12.62 62.41,12.62 59.73,15.3 IC1.3
N$39  (via drill 0.3)
  Top 0.175: IC5.3 28.8,29.4 v29,29.4
  Bottom 0.175: J2.D- 38,3.3 37.2,4.1 29.6,4.1 27.8,5.9 27.8,13.7 29,14.9 v29,29.4
N$40  (via drill 0.3)
  Top 0.175: IC5.4 28.3,29.5 v29,30.2
  Bottom 0.175: J2.D+ 40,3.7 39.1,4.6 29.7,4.6 29.2,5.1 29.2,11.7 29.8,12.3 29.8,20.9 29.6,21.1 29.6,29.6 v29,30.2
N$41
  pour Top (no thermals): 66.5,28.45 68.81,28.45 68.81,27.03 69.88,25.96 70.76,25.96 70.76,24.89 70.59,24.71 70.05,24.71 69.52,25.25 69.52,25.6 68.45,26.67 66.5,26.67
N$42
  Top 0.2: R17.2 75.55,1.37 SW2.P1
N$43
  Top 0.178: BATLOW.C 54.93,1.41 55.83,2.31 55.83,3.41 U7.4
N$44
  Top 0.178: BATLOW.A 53.62,2.94 R22.1
N$45
  Top 0.178: R26.1 61.78,3.65 | 61.78,3.65 U7.5 | U7.2 U7.7 62.09,6.19 62.94,5.33 62.94,4.09 62.5,3.65 61.78,3.65
N$46
  Top 0.178: R26.2 R23.1 58.65,3.89 59.68,4.92 U7.6
N$47
  Top 0.178: R24.1 R25.2 56.07,7.9 U7.1
N$48
  Top 0.178: R27.1 46.41,18.49 46.7,18.79 U5.10
N$49  (via drill 0.3)
  Top 0.178: v53.34,19.38 53.13,19.59 U5.5
  Bottom 0.178: U6.3 54,18.72 v53.34,19.38
N$50  (via drill 0.3)
  Top 0.178: U5.4 52.28,19.19 v52.98,18.49
  Bottom 0.178: U6.2 52.98,12.58 v52.98,18.49
OCSN1
  Top 0.175: IC6.3 24.93,1.97 20.1,6.8 20.1,25.5 21.1,26.5 23.6,26.5 24.3,25.8 IC5.13
OCSN2
  Top 0.175: IC6.2 24.96,3.23 20.9,7.3 20.9,20.8 23.1,23 23.6,23 24.4,23.8 IC5.17
OCSN3
  Top 0.175: IC5.19 25.55,22.55 24,21 24,18.2 25.2,17 33.36,17
  Top 0.178: 33.36,17 37.34,20.98 39.47,20.98 43.56,25.07 52.09,25.07 54.76,27.74 57.34,27.74 | 57.16,27.91 IC7.3 | 57.34,27.74 IC7.3 | 57.34,27.74 arc-90 IC7.3
OCSN4
  Top 0.175: IC5.21 26.8,21.9 26.3,21.4 25.4,21.4 24.8,20.8 24.8,18.4 25.4,17.8 32.73,17.8
  Top 0.178: 32.73,17.8 36.98,22.05 39.29,22.05 43.2,25.96 50.49,25.96 55.83,31.29 58.5,31.29 58.85,30.94 58.85,29.52 58.32,28.98 IC7.2
PRTPWR1
  Top 0.175: IC6.4 25.61,0.69 19.7,6.6 19.7,25.8 20.8,26.9 23.8,26.9 24.4,26.3 IC5.12
PRTPWR2
  Top 0.175: IC5.16 24.3,24.3 23.4,23.4 22.9,23.4 20.5,21 20.5,7.1 25,2.6 27.7,2.6 27.9,2.8 27.9,4.3 27.7,4.5 IC6.1
PRTPWR3
  Top 0.175: IC5.18 25.05,22.55 23.6,21.1 23.6,18.1 25.1,16.6 33.85,16.6
  Top 0.178: 33.85,16.6 37.69,20.45 39.83,20.45 43.92,24.54 53.87,24.54 55.78,26.44 IC7.4
PRTPWR4
  Top 0.175: IC5.20 26.3,22 26.1,21.8 25.3,21.8 24.4,20.9 24.4,18.3 25.3,17.4 32.87,17.4
  Top 0.178: 32.87,17.4 37.16,21.69 39.47,21.69 43.38,25.6 51.03,25.6 55.65,30.23 56.72,30.23 | 57.21,30.4 IC7.1 57.34,30.23
  Top 0.406: 56.72,30.23 57.37,30.23 IC7.1
RESET_OUT#
  Top 0.175: U4.G1 40,16.8 39,15.8 38.8,15.8 38.7,15.7 38.7,15.45 R15.1 37.35,14.3 36.3,14.3 35.8,13.8 35.8,12.8 35.3,12.3 33.7,12.3 33.2,11.8 31.7,11.8 31.2,11.3 29.7,11.3 29.54,11.14 U1.36
UART1_RX  (via drill 0.3)
  Top 0.175: U1.61 34.74,8.94 34.9,9.1 36.4,9.1
  Top 0.178: U5.9 45.15,19.19 v44.45,18.49 | JP4.9 38.62,13.2 37.69,12.27 37.69,10.39 36.4,9.1
  Bottom 0.178: v44.45,18.49 44.45,16 42.32,13.87 42.32,12.98 41.25,11.91 40.09,11.91 JP4.9
UART1_TX  (via drill 0.3)
  Top 0.175: U1.46 31.54,11.14 31.7,11.3 33.2,11.3 33.8,11.9 36.2,11.9 36.8,12.5 JP4.8
  Top 0.178: U5.8 43.95,19.59 v43.92,19.56
  Bottom 0.178: v43.92,19.56 43.2,18.85 43.2,16 41.6,14.4 38.41,14.4 37.52,13.51 37.11,13.51 JP4.8
UART2_RX  (via drill 0.3)
  Top 0.175: U1.22 26.74,11.16 26.1,11.8 24.8,11.8 23.8,12.8 23.8,14.5 24.1,14.8 36.8,14.8 v37.2,15.2
  Top 0.178: IC2.15 69.59,30.68 arc90 v69.58,30.66
  Bottom 0.178: v37.2,15.2 51.89,29.89 68.81,29.89 v69.58,30.66
UART2_TX  (via drill 0.3)
  Top 0.175: U1.27 27.94,6.46 28,6.4 30.4,6.4 v30.6,6.6
  Top 0.178: IC2.2 72.38,27.73 arc90 72.72,27.38 72.9,27.38 v74.32,27.38
  Bottom 0.178: v30.6,6.6 35.74,11.74 35.74,13.87 36.09,14.22 37.16,14.22 52.27,29.34 68.99,29.34 70.76,27.56 74.14,27.56 v74.32,27.38
USB2_PWR
  Top 0.7: IC6.8 33.9,4.5 J2.5V
USB3_PWR
  Top 0.635: J3.5V 46.77,33.6 48.18,32.18 58.67,32.18 59.56,31.29 59.56,26.67 59.79,26.44 IC7.5
USB4_PWR  (via drill 0.64)
  Top 0.635: IC7.8 62.59,30.27 v62.59,31.65
  Bottom 0.635: v62.59,31.65 62.05,32.18 32.89,32.18 32.63,32.45 32,33.08 J4.5V
USB_DM  (via drill 0.3)
  Top 0.175: 32.4,24.3 IC5.30 32.3,24.3 v32.5,24.1 | U1.18 25.94,9.66 26.2,9.4 30.7,9.4 v30.8,9.3
  Bottom 0.175: v30.8,9.3 31,9.4 31,11.7 31.8,12.5 31.8,21.7 32.6,22.5 32.6,24 v32.5,24.1
USB_DP  (via drill 0.3)
  Top 0.175: U1.16 25.54,9.56 26.1,9 30.3,9 30.6,8.7 | v33.2,24.6 33,24.8 IC5.31
  Top 0.178: 30.6,8.7 31.2,8.7 v31.62,9.12
  Bottom 0.175: v33.2,24.6 33.2,14.2 33.8,13.6 33.8,11.3
  Bottom 0.178: v31.62,9.12 33.8,11.3
V_1P80  (via drill 0.3)
  Top 0.175: U1.12 24.74,11.26 JP4.1 22.8,14.1 23.9,15.2 36.2,15.2 37.55,16.55 R15.2 38.6,16.65 v38.6,17.5
  Top 0.178: v70.41,29.34 71.66,29.34 IC2.1 71.72,28.36 C10.1 | R27.2 45.38,16.6 R20.2 43.78,16.49 v40.54,19.74 41.07,20.27 46.05,20.27 46.64,20.86 C12.1 46.77,20.8 47,21.03 47.6,21.03 48,20.63 U5.7
  Bottom 0.178: v38.6,17.5 40.69,19.59 | 40.69,19.59 51.68,30.58 65.25,30.58 66.14,31.47 69.88,31.47 70.23,31.11 70.23,29.52 v70.41,29.34 | v40.54,19.74 40.69,19.59
V_3P30
  Top 0.175: U1.10 U1.8
VCC  (via drill 0.3)
  Top 0.178: 69.06,21.52 69.34,21.52 | R7.1 67.29,18.76 R8.1 69.34,18.46 69.34,20.27 69.84,20.77 C24.1 | IC9.P12 74.2,25.85 C11.1 75.25,24.8 C6.1 | IC9.P12 IC9.P11 | IC9.P13 73.44,26.64 IC9.P12 | R22.2 53.62,8.46 55.12,9.96 60.1,9.96 60.45,9.6 60.45,8.86 R24.2 61.27,8.4 U7.8 63.33,7.46 C16.2 64.06,7.59 64.72,6.93 64.72,3.73 v64.36,3.38
  Top 1: J15.PWR 4,34.1 4.9,35 11.4,35 12,34.4 | J14.PWR 12,34.4 | 12,34.4 12.6,35 19.4,35 20,34.4 J13.PWR | J10.PWR 4,1.6 4.8,0.8 11.6,0.8 12,1.2 | 12,1.2 J12.PWR | J11.PWR 20,1.5 19.3,0.8 12.4,0.8 12,1.2
  Top 1.016: BAT.P$3 77.86,11.86 79.6,13.6 79.6,18 76.86,20.74 JP3.2 76.33,20.47 75.21,20.47 | 75.21,20.47 C19.1 72.68,20.77 C24.1 69.75,21.51 69.34,21.52 68.88,21.52 68.28,21.51 | C6.1 75.21,23.36 75.21,20.47
  Bottom 0.178: v64.36,3.38 64.36,0.98 64.54,0.8
  Bottom 1: J11.PWR 20,1.4 20.6,0.8 64.54,0.8 76.2,0.8 77.4,2 BAT.P$3 | J13.PWR 20,34.4 20.6,35 79,35 79.8,34.2 79.8,24.2
  Bottom 1.016: 79.8,24.2 79.8,23.94 JP3.2
  pour Top (no thermals): 72.6,27 72.8,27 73.4,27.01 75.8,27.01 75.8,25.6 75.8,25.4 75.8,21.63 74.43,21.61 74.38,24.81 73.8,24.8 73.12,24.8 73.12,26.23 72.6,26.24
  pour Top (no thermals): 66.52,23.33 69.69,23.31 69.69,21.97 71.51,21.62 77.85,21.66 77.87,20.27 71.78,20.3 69.43,20.3 69.41,20.96 67.02,21.03 67.02,22.23 67,22.53 66.42,22.53 66.42,23.23
VCC_DX  (via drill 0.3, 0.5)
  Top 0.15: 3.77,12.82 C2.1 | R4.2 R3.2
  Top 0.175: IC3.9 IC3.10 3.77,12.82 | R6.2 5.25,17.5 IC3.1 7.12,17.32 IC4.8 7.5,16.95 7.5,18.1 7.95,18.55 R5.2
  Top 0.2: R3.2 R6.2 | IC3.1 6.67,17.32 v6.7,17.3 | IC3.10 3.77,13.18 3.5,12.9 3.1,12.9 v2.9,13
  Top 0.3: IC6.5 29.8,0.69 29,1.5 v29,2.2
  Bottom 0.2: v6.7,17.3 5,15.6 2.9,13.5 v2.9,13
  Bottom 0.3: v29,2.2 29,2.5 18.8,12.7 7.9,12.7 5,15.6

### Text on the board
tPlace: IC5 | VBAT | GND | GND | 5V | 3.3V | GND | Nico v1.1.0
tNames: U4